# Altium schematic sheet 80PIN_FMU3_REV_E.SchDoc: Pixhawk_mini_8L.sch
size A4; Date: 18/08/2014 1:53:28 PM; DrawnBy: Philip Rowse; SheetNumber: 9; SheetTotal: 10
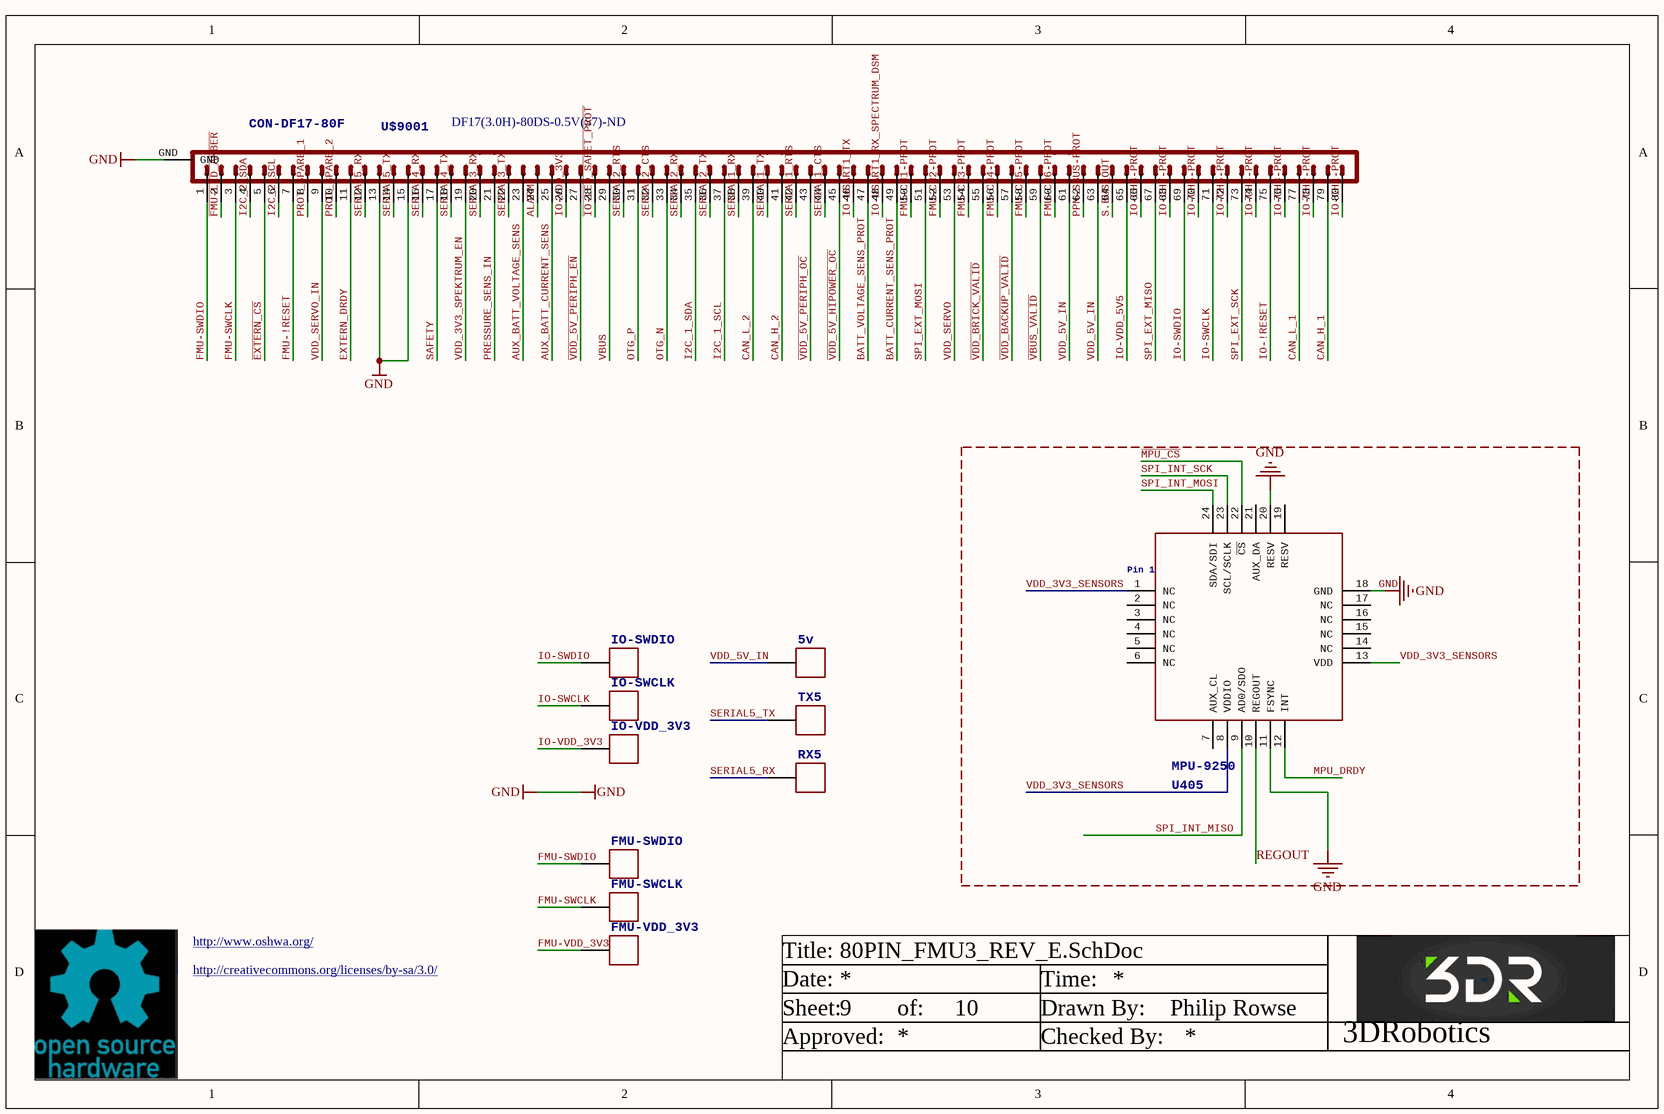
[diagram p0: 80PIN_FMU3_REV_E.SchDoc]

## Parts
5v  PAD.04  [PAD.04X.04]  (value not drawn)
FMU-SWCLK  PAD.04  [PAD.04X.04]  (value not drawn)
FMU-SWDIO  PAD.04  [PAD.04X.04]  (value not drawn)
FMU-VDD_3V3  PAD.04  [PAD.04X.04]  (value not drawn)
IO-SWCLK  PAD.04  [PAD.04X.04]  (value not drawn)
IO-SWDIO  PAD.04  [PAD.04X.04]  (value not drawn)
IO-VDD_3V3  PAD.04  [PAD.04X.04]  (value not drawn)
RX5  PAD.04  [PAD.04X.04]  (value not drawn)
TX5  PAD.04  [PAD.04X.04]  (value not drawn)
U405  MPU-9250  [MPU-9250]
U$9001  CON-DF17-80F  Supplier Part Number 1: DF17(3.0H)-80DS-0.5V(57)-ND  [CON-DF17-80F]

## Nets
GND: U405.11(FSYNC) U405.18(GND) U405.20(RESV) U$9001.13 U$9001.15 U$9001.GND
ALARM: U$9001.24
AUX_BATT_CURRENT_SENS: U$9001.25
AUX_BATT_VOLTAGE_SENS: U$9001.23
BATT_CURRENT_SENS_PROT: U$9001.49
BATT_VOLTAGE_SENS_PROT: U$9001.47
CAN_H_1: U$9001.79
CAN_H_2: U$9001.41
CAN_L_1: U$9001.77
CAN_L_2: U$9001.39
~{EXTERN_CS}: U$9001.5
EXTERN_DRDY: U$9001.11
~{FMU-LED_AMBER}: U$9001.2
FMU-!RESET: U$9001.7
FMU-CH1-PROT: U$9001.50
FMU-CH2-PROT: U$9001.52
FMU-CH3-PROT: U$9001.54
FMU-CH4-PROT: U$9001.56
FMU-CH5-PROT: U$9001.58
FMU-CH6-PROT: U$9001.60
FMU-SWCLK: FMU-SWCLK.P$1 U$9001.3
FMU-SWDIO: FMU-SWDIO.P$1 U$9001.1
FMU-VDD_3V3: FMU-VDD_3V3.P$1
I2C_1_SCL: U$9001.37
I2C_1_SDA: U$9001.35
I2C_2_SCL: U$9001.6
I2C_2_SDA: U$9001.4
~{IO-LED_SAFET_PROT}: U$9001.28
IO-!RESET: U$9001.75
IO-CH1-PROT: U$9001.80
IO-CH2-PROT: U$9001.78
IO-CH3-PROT: U$9001.76
IO-CH4-PROT: U$9001.74
IO-CH5-PROT: U$9001.72
IO-CH6-PROT: U$9001.70
IO-CH7-PROT: U$9001.68
IO-CH8-PROT: U$9001.66
IO-SWCLK: IO-SWCLK.P$1 U$9001.71
IO-SWDIO: IO-SWDIO.P$1 U$9001.69
IO-USART1_RX_SPECTRUM_DSM: U$9001.48
IO-USART1_TX: U$9001.46
IO-VDD_3V3: IO-VDD_3V3.P$1 U$9001.26
IO-VDD_5V5: U$9001.65
~{MPU_CS}: U405.22(~{CS})
MPU_DRDY: U405.12(INT)
OTG_N: U$9001.33
OTG_P: U$9001.31
PPM-SBUS-PROT: U$9001.62
PRESSURE_SENS_IN: U$9001.21
PROT_SPARE_1: U$9001.8
PROT_SPARE_2: U$9001.10
REGOUT: U405.10(REGOUT)
S.BUS_OUT: U$9001.64
SAFETY: U$9001.17
SERIAL1_CTS: U$9001.44
SERIAL1_RTS: U$9001.42
SERIAL1_RX: U$9001.38
SERIAL1_TX: U$9001.40
SERIAL2_CTS: U$9001.32
SERIAL2_RTS: U$9001.30
SERIAL2_RX: U$9001.34
SERIAL2_TX: U$9001.36
SERIAL3_RX: U$9001.20
SERIAL3_TX: U$9001.22
SERIAL4_RX: U$9001.16
SERIAL4_TX: U$9001.18
SERIAL5_RX: RX5.P$1 U$9001.12
SERIAL5_TX: TX5.P$1 U$9001.14
SPI_EXT_MISO: U$9001.67
SPI_EXT_MOSI: U$9001.51
SPI_EXT_SCK: U$9001.73
SPI_INT_MISO: U405.9(AD0/SDO)
SPI_INT_MOSI: U405.24(SDA/SDI)
SPI_INT_SCK: U405.23(SCL/SCLK)
~{VBUS_VALID}: U$9001.59
~{VDD_5V_HIPOWER_OC}: U$9001.45
~{VDD_5V_PERIPH_EN}: U$9001.27
~{VDD_5V_PERIPH_OC}: U$9001.43
~{VDD_BACKUP_VALID}: U$9001.57
~{VDD_BRICK_VALID}: U$9001.55
VBUS: U$9001.29
VDD_3V3_SENSORS: U405.1(NC) U405.8(VDDIO) U405.13(VDD)
VDD_3V3_SPEKTRUM_EN: U$9001.19
VDD_5V_IN: 5v.P$1 U$9001.61 U$9001.63
VDD_SERVO: U$9001.53
VDD_SERVO_IN: U$9001.9

Not connected (* = marked no-connect by the designer): U405 2(NC) 3(NC) 4(NC) 5(NC) 6(NC) 7(AUX_CL) 14(NC) 15(NC) 16(NC) 17(NC) 19(RESV) 21(AUX_DA)

## Notes on the sheet
- http://www.oshwa.org/
- http://creativecommons.org/licenses/by-sa/3.0/
- Title:
- Date:
- Time:
- Sheet:
- Approved:
- of:
- Drawn By:
- Checked By:
- 3DRobotics

## Library data of the parts
5v FMU-SWCLK FMU-SWDIO FMU-VDD_3V3 IO-SWCLK IO-SWDIO IO-VDD_3V3 RX5 TX5 = PAD.04: BOM: EXCLUDE; PARTNO: *
U405 = MPU-6500: PARTNO: MPU-9250; Pin 1: Pin 1
U$9001 = CON-DF17-80F: CONN RECEPT 80POS .5MM SMD W/FIT; 3DR_PARTNO: ECM0518; PARTNO: DF17(3.0H)-80DS-0.5V(57); Supplier 1: Digi-Key